# EAGLE design espertowatch_v2 (EAGLE 9.0.1)

## Sheet 1 of 2
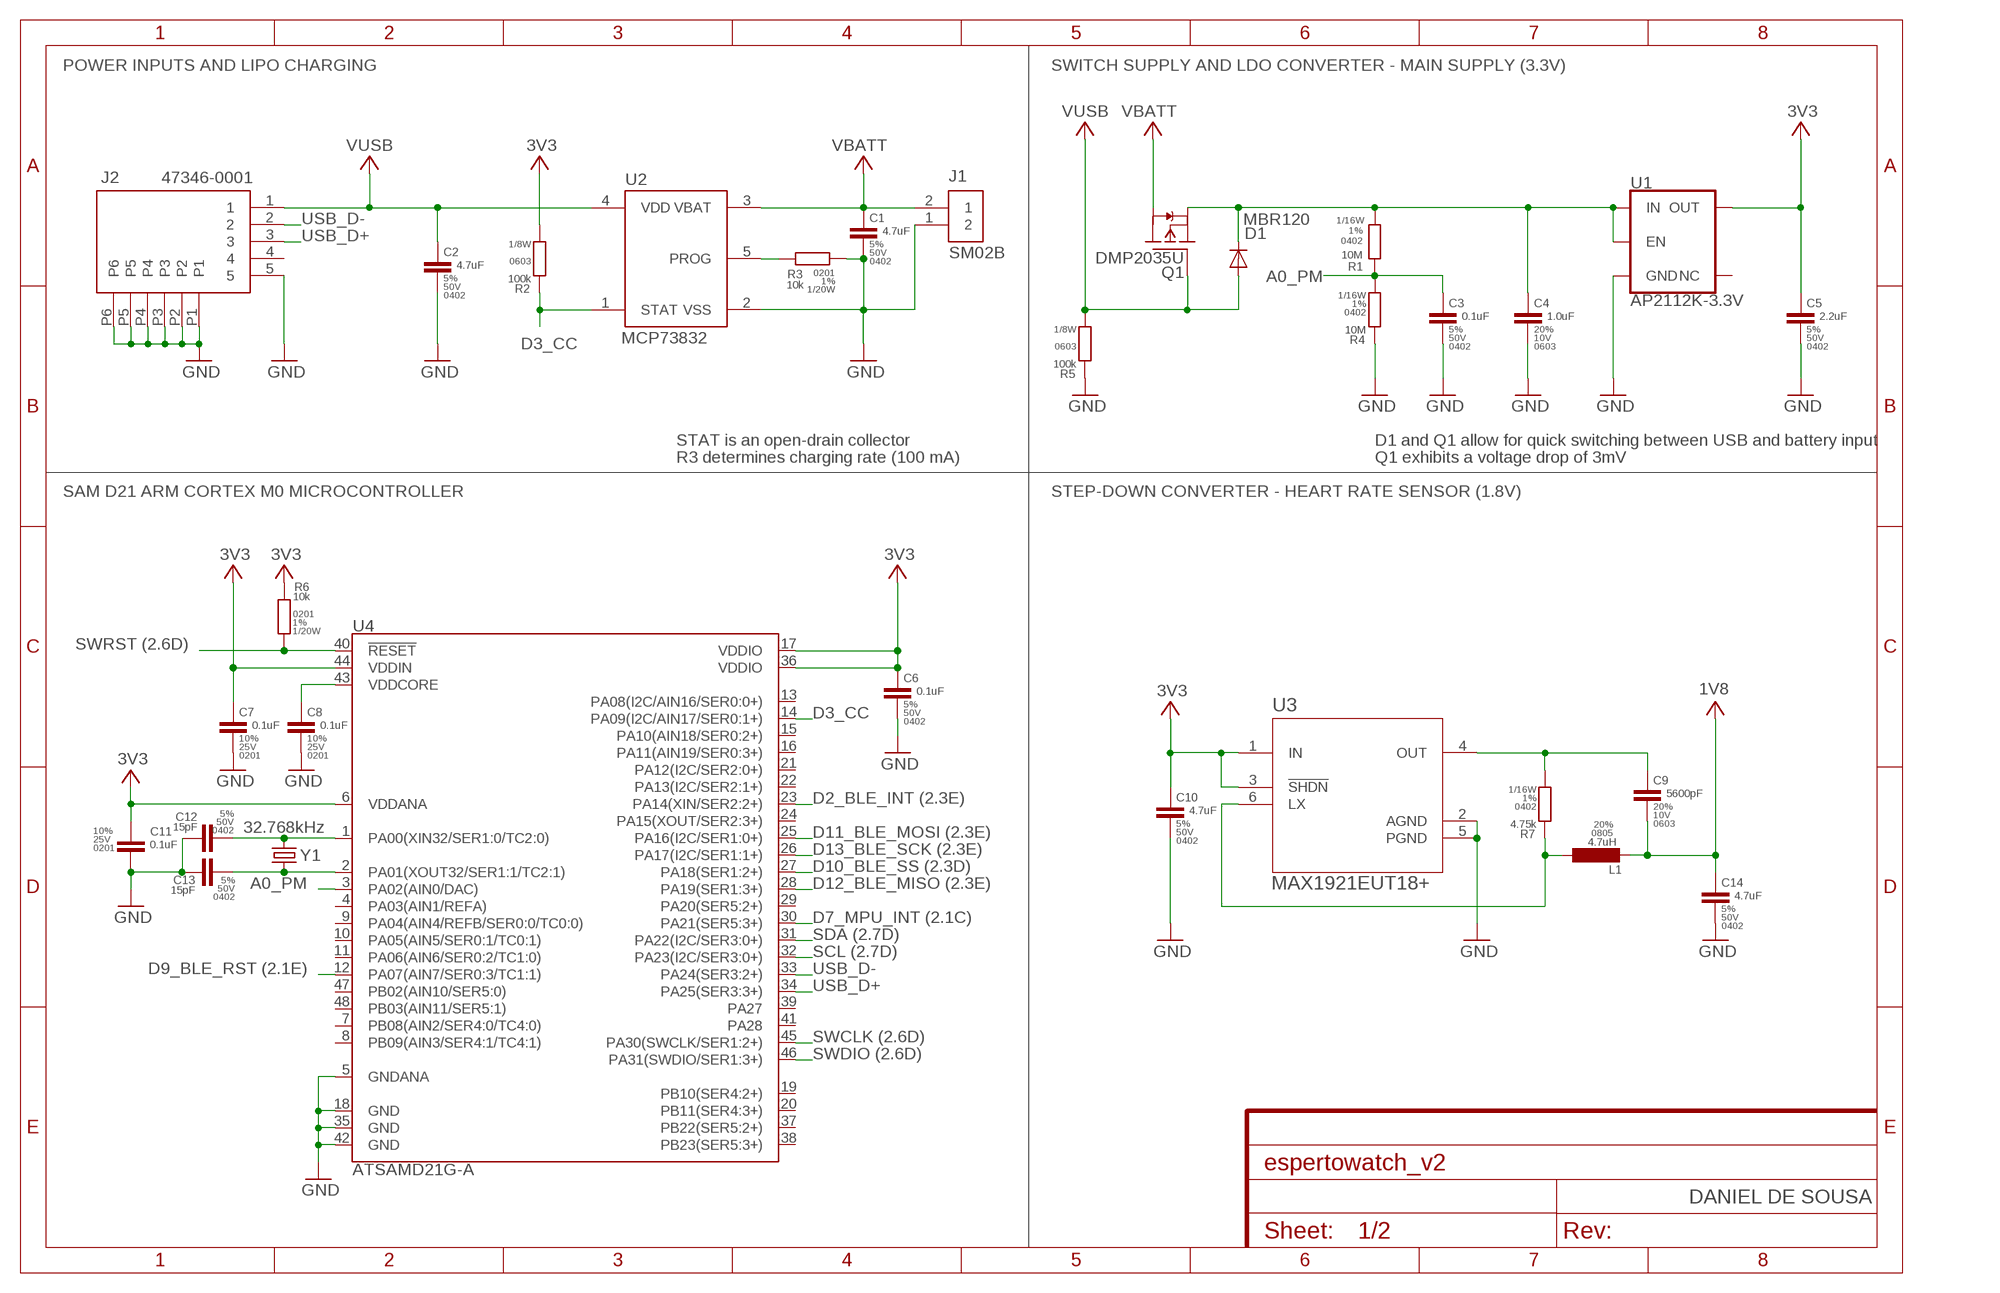
[diagram p0: schematic, sheet 1]

### Parts
C1  4.7uF  C-EUC0402_MURATA_GRM15-GJM15  [C0402_MURATA_GRM15-GJM15]
C2  4.7uF  C-EUC0402_MURATA_GRM15-GJM15  [C0402_MURATA_GRM15-GJM15]
C3  0.1uF  C-EUC0402_MURATA_GRM15-GJM15  [C0402_MURATA_GRM15-GJM15]
C4  1.0uF  C-EUC0603_MURATA_GRM18  [C0603_MURATA_GRM18]
C5  2.2uF  C-EUC0402_MURATA_GRM15-GJM15  [C0402_MURATA_GRM15-GJM15]
C6  0.1uF  C-EUC0402_MURATA_GRM15-GJM15  [C0402_MURATA_GRM15-GJM15]
C7  0.1uF  C-EUC0201_MURATA_GRM03  [C0201_MURATA_GRM03]
C8  0.1uF  C-EUC0201_MURATA_GRM03  [C0201_MURATA_GRM03]
C9  5600pF  C-EUC0603_MURATA_GRM18  [C0603_MURATA_GRM18]
C10  4.7uF  C-EUC0402_MURATA_GRM15-GJM15  [C0402_MURATA_GRM15-GJM15]
C11  0.1uF  C-EUC0201_MURATA_GRM03  [C0201_MURATA_GRM03]
C12  15pF  C-EUC0402_MURATA_GRM15-GJM15  [C0402_MURATA_GRM15-GJM15]
C13  15pF  C-EUC0402_MURATA_GRM15-GJM15  [C0402_MURATA_GRM15-GJM15]
C14  4.7uF  C-EUC0402_MURATA_GRM15-GJM15  [C0402_MURATA_GRM15-GJM15]
D1  MBR120  AS-ITM-00111  [SOD-123FL]
J1  SM02B  AS-ITM-00231  [JST_SH_2X1]
J2  47346-0001  AS-ITM-00021  [MICRO_USB]
L1  4.7uH  L-EUL0805_TDK_MLZ  [L0805_TDK_MLZ]
Q1  DMP2035U  AS-ITM-00024  [SOT23]
R1  10M  CRCW04021M00FKED  [R0402_VISHAY_CRCW0402]
R2  100k  R-EU_R0603_VISHAY_MCT0603  [R0603_VISHAY_MCT0603]
R3  10k  CRCW020110K0FKED  [R0201_VISHAY_CRCW0201]
R4  10M  CRCW04021M00FKED  [R0402_VISHAY_CRCW0402]
R5  100k  R-EU_R0603_VISHAY_MCT0603  [R0603_VISHAY_MCT0603]
R6  10k  CRCW020110K0FKED  [R0201_VISHAY_CRCW0201]
R7  4.75k  R-EU_R0402_VISHAY_CRCW0402  [R0402_VISHAY_CRCW0402]
U1  AP2112K-3.3V  V_REG_AP2112K-3.3V  [SOT23-5]
U2  MCP73832  AS-ITM-00136  [SOT-23]
U3  MAX1921EUT18+  MAX1921EUT18+T  [21-0058I]
U4  ATSAMD21G-A  [TQFP-48]
Y1  32.768kHz  CRYSTAL-32.768KHZSMD-3.2X1.5  [CRYSTAL-SMD-3.2X1.5MM]

### Nets
1V8: C9.2 C14.1 L1.P$2 ; also sheet 2
3V3: C5.1 C6.1 C7.1 C10.1 C11.1 R2.2 R6.1 U1.5(OUT) U3.1(IN) U3.3(!SHDN) U4.6(VDDANA) U4.17(VDDIO) U4.36(VDDIO) U4.44(VDDIN) ; also sheet 2
A0_PM: C3.1 R1.1 R4.2 U4.3(PA02(AIN0/DAC))
D2_BLE_INT: U4.23(PA14(XIN/SER2:2+)) ; also sheet 2
D3_CC: R2.1 U2.1(STAT) U4.14(PA09(I2C/AIN17/SER0:1+))
D7_MPU_INT: U4.30(PA21(SER5:3+)) ; also sheet 2
D9_BLE_RST: U4.12(PA07(AIN7/SER0:3/TC1:1)) ; also sheet 2
D10_BLE_SS: U4.27(PA18(SER1:2+)) ; also sheet 2
D11_BLE_MOSI: U4.25(PA16(I2C/SER1:0+)) ; also sheet 2
D12_BLE_MISO: U4.28(PA19(SER1:3+)) ; also sheet 2
D13_BLE_SCK: U4.26(PA17(I2C/SER1:1+)) ; also sheet 2
GND: C1.2 C2.2 C3.2 C4.2 C5.2 C6.2 C7.2 C8.2 C10.2 C11.2 C12.1 C13.1 C14.2 J1.1 J2.5 J2.P1 J2.P2 J2.P3 J2.P4 J2.P5 J2.P6 R3.2 R4.1 R5.1 U1.2(GND) U2.2(VSS) U3.2(AGND) U3.5(PGND) U4.5(GNDANA) U4.18(GND) U4.35(GND) U4.42(GND) ; also sheet 2
N$1: C4.1 D1.C Q1.E(S) R1.2 U1.1(IN) U1.3(EN)
N$2: R3.1 U2.5(PROG)
N$5: C8.1 U4.43(VDDCORE)
N$6: C12.2 U4.1(PA00(XIN32/SER1:0/TC2:0)) Y1.P$2
N$7: C13.2 U4.2(PA01(XOUT32/SER1:1/TC2:1)) Y1.P$1
N$10: L1.P$1 R7.1 U3.6(LX)
N$15: C9.1 R7.2 U3.4(OUT)
SCL: U4.32(PA23(I2C/SER3:0+)) ; also sheet 2
SDA: U4.31(PA22(I2C/SER3:0+)) ; also sheet 2
SWCLK: U4.45(PA30(SWCLK/SER1:2+)) ; also sheet 2
SWDIO: U4.46(PA31(SWDIO/SER1:3+)) ; also sheet 2
SWRST: R6.2 U4.40(!RESET!) ; also sheet 2
USB_D+: J2.3 U4.34(PA25(SER3:3+))
USB_D-: J2.2 U4.33(PA24(SER3:2+))
VBATT: C1.1 J1.2 Q1.C(D) U2.3(VBAT)
VUSB: C2.1 D1.A J2.1 Q1.B(G) R5.2 U2.4(VDD)
Unconnected: J2.4 U1.4(NC) U4.4(PA03(AIN1/REFA)) U4.7(PB08(AIN2/SER4:0/TC4:0)) U4.8(PB09(AIN3/SER4:1/TC4:1)) U4.9(PA04(AIN4/REFB/SER0:0/TC0:0)) U4.10(PA05(AIN5/SER0:1/TC0:1)) U4.11(PA06(AIN6/SER0:2/TC1:0)) U4.13(PA08(I2C/AIN16/SER0:0+)) U4.15(PA10(AIN18/SER0:2+)) U4.16(PA11(AIN19/SER0:3+)) U4.19(PB10(SER4:2+)) U4.20(PB11(SER4:3+)) U4.21(PA12(I2C/SER2:0+)) U4.22(PA13(I2C/SER2:1+)) U4.24(PA15(XOUT/SER2:3+)) U4.29(PA20(SER5:2+)) U4.37(PB22(SER5:2+)) U4.38(PB23(SER5:3+)) U4.39(PA27) U4.41(PA28) U4.47(PB02(AIN10/SER5:0)) U4.48(PB03(AIN11/SER5:1))

### Notes on the sheet
- POWER INPUTS AND LIPO CHARGING | SWITCH SUPPLY AND LDO CONVERTER - MAIN SUPPLY (3.3V)
- STAT is an open-drain collector | D1 and Q1 allow for quick switching between USB and battery input
- R3 determines charging rate (100 mA) | Q1 exhibits a voltage drop of 3mV
- SAM D21 ARM CORTEX M0 MICROCONTROLLER | STEP-DOWN CONVERTER - HEART RATE SENSOR (1.8V)
- DANIEL DE SOUSA

## Sheet 2 of 2
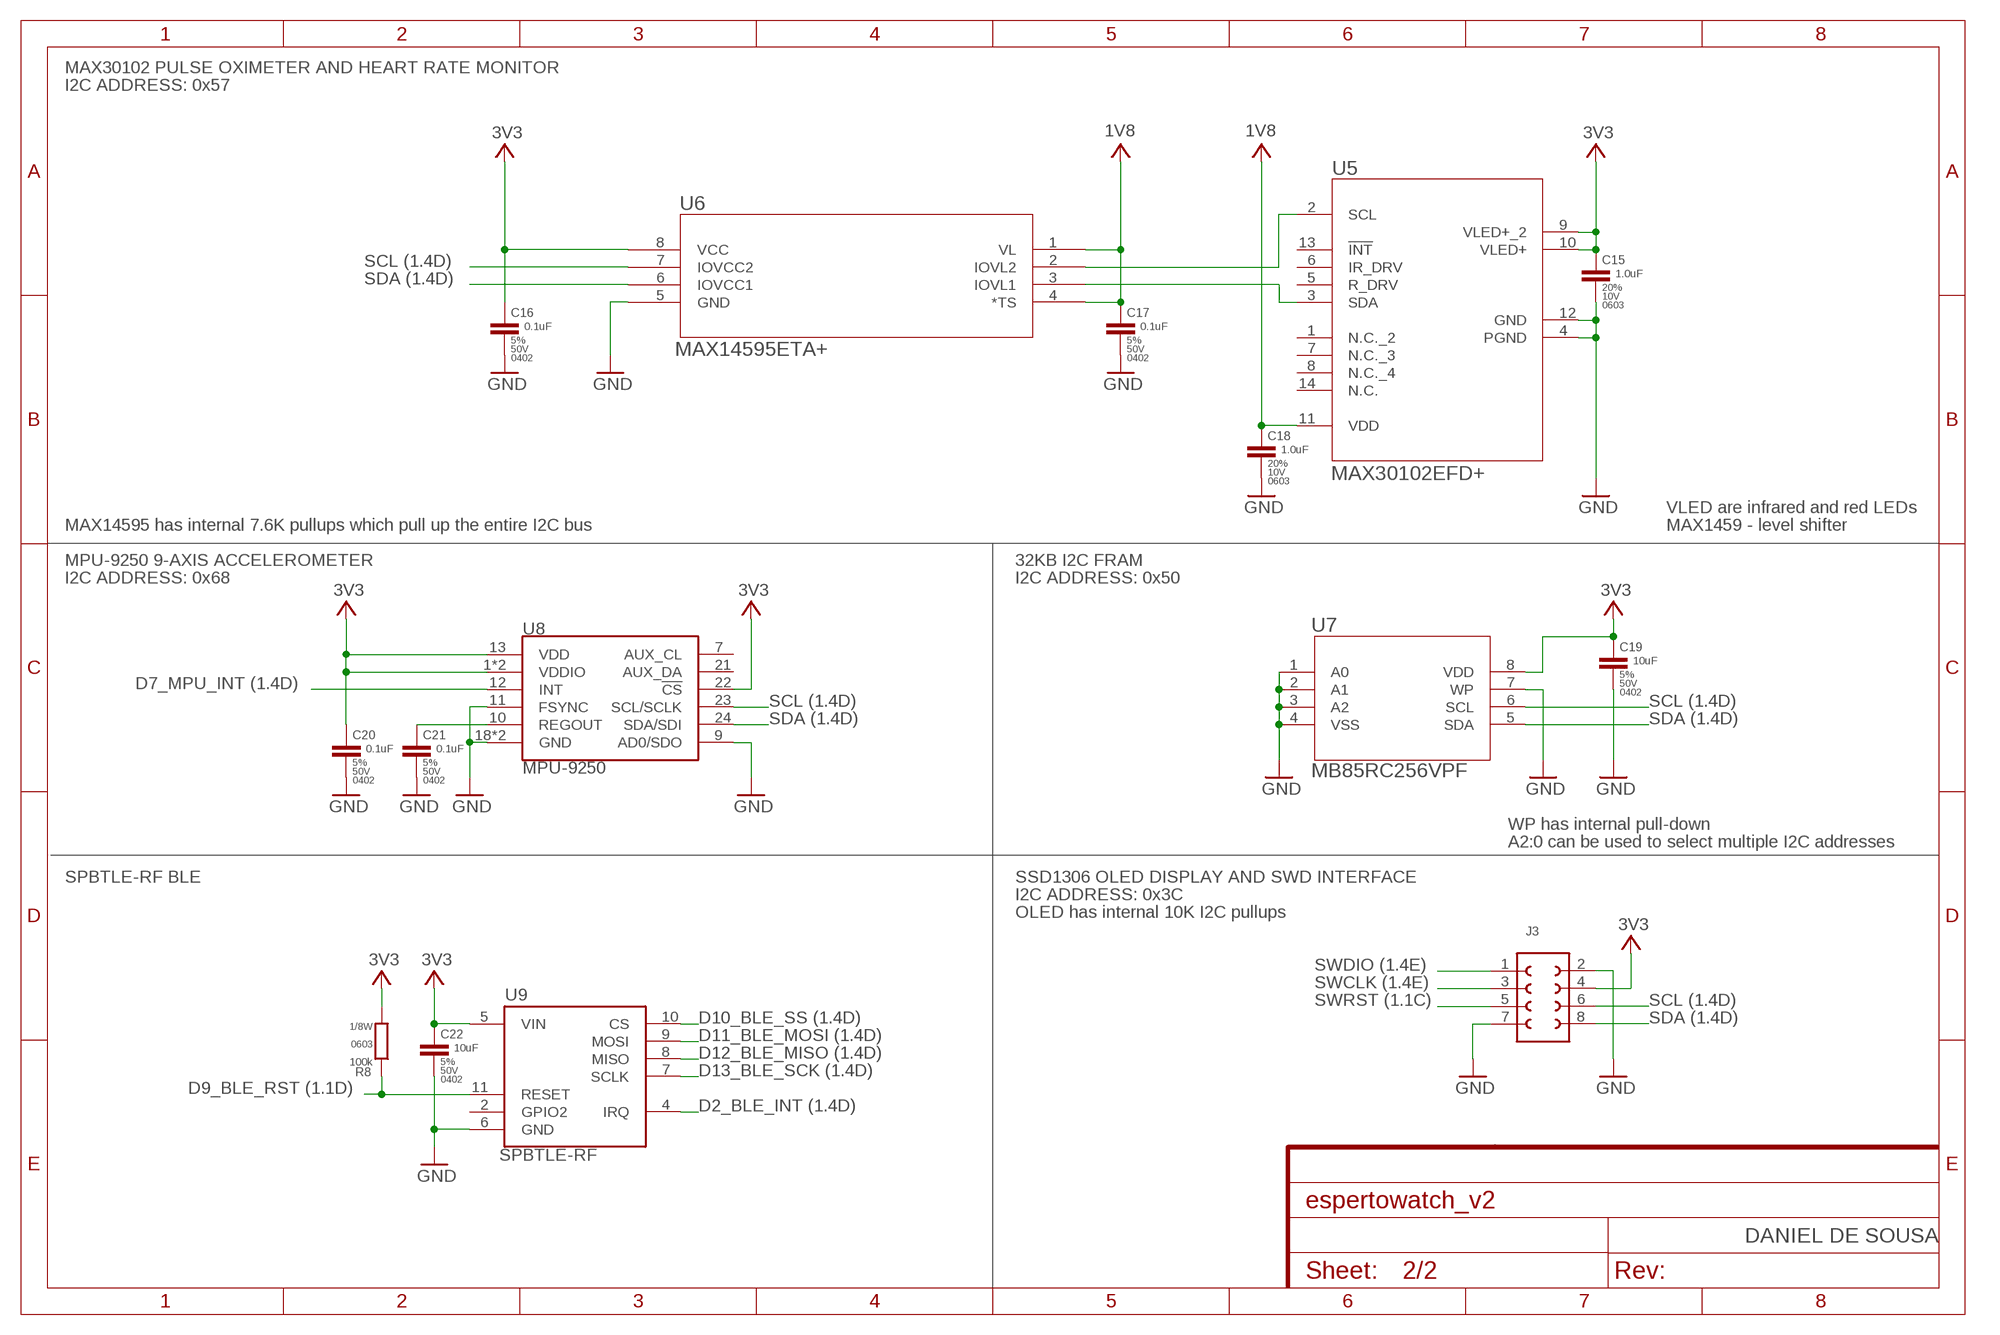
[diagram p1: schematic, sheet 2]

### Parts
C15  1.0uF  C-EUC0603_MURATA_GRM18  [C0603_MURATA_GRM18]
C16  0.1uF  C-EUC0402_MURATA_GRM15-GJM15  [C0402_MURATA_GRM15-GJM15]
C17  0.1uF  C-EUC0402_MURATA_GRM15-GJM15  [C0402_MURATA_GRM15-GJM15]
C18  1.0uF  C-EUC0603_MURATA_GRM18  [C0603_MURATA_GRM18]
C19  10uF  C-EUC0402_MURATA_GRM15-GJM15  [C0402_MURATA_GRM15-GJM15]
C20  0.1uF  C-EUC0402_MURATA_GRM15-GJM15  [C0402_MURATA_GRM15-GJM15]
C21  0.1uF  C-EUC0402_MURATA_GRM15-GJM15  [C0402_MURATA_GRM15-GJM15]
C22  10uF  C-EUC0402_MURATA_GRM15-GJM15  [C0402_MURATA_GRM15-GJM15]
J3  610X08243021  [610X08243021]
R8  100k  R-EU_R0603_VISHAY_MCT0603  [R0603_VISHAY_MCT0603]
U5  MAX30102EFD+  MAX30102EFD+21-0880B-M  [21-0880B-M]
U6  MAX14595ETA+  MAX14595ETAT  [21-0487A]
U7  MB85RC256VPF  INC.  [FPT-8P-M02]
U8  MPU-9250  [QFN24-3X3]
U9  SPBTLE-RF  AS-ITM-00294  [SPBTLE-RF]

### Nets
1V8: C17.1 C18.1 U5.11(VDD) U6.1(VL) U6.4(*TS) ; also sheet 1
3V3: C15.1 C16.1 C19.1 C20.1 C22.1 J3.4 R8.2 U5.9(VLED+_2) U5.10(VLED+) U6.8(VCC) U7.8(VDD) U8.1(VDDIO) U8.8(VDDIO) U8.13(VDD) U8.22(!CS) U9.5(VIN) ; also sheet 1
D2_BLE_INT: U9.4(IRQ) ; also sheet 1
D7_MPU_INT: U8.12(INT) ; also sheet 1
D9_BLE_RST: R8.1 U9.11(RESET) ; also sheet 1
D10_BLE_SS: U9.10(CS) ; also sheet 1
D11_BLE_MOSI: U9.9(MOSI) ; also sheet 1
D12_BLE_MISO: U9.8(MISO) ; also sheet 1
D13_BLE_SCK: U9.7(SCLK) ; also sheet 1
GND: C15.2 C16.2 C17.2 C18.2 C19.2 C20.2 C21.2 C22.2 J3.2 J3.7 U5.4(PGND) U5.12(GND) U6.5(GND) U7.1(A0) U7.2(A1) U7.3(A2) U7.4(VSS) U7.7(WP) U8.9(AD0/SDO) U8.11(FSYNC) U8.18(GND) U8.20(GND) U9.6(GND) ; also sheet 1
N$14: C21.1 U8.10(REGOUT)
N$16: U5.2(SCL) U6.2(IOVL2)
N$17: U5.3(SDA) U6.3(IOVL1)
SCL: J3.6 U6.7(IOVCC2) U7.6(SCL) U8.23(SCL/SCLK) ; also sheet 1
SDA: J3.8 U6.6(IOVCC1) U7.5(SDA) U8.24(SDA/SDI) ; also sheet 1
SWCLK: J3.3 ; also sheet 1
SWDIO: J3.1 ; also sheet 1
SWRST: J3.5 ; also sheet 1
Unconnected: U5.1(N.C._2) U5.5(R_DRV) U5.6(IR_DRV) U5.7(N.C._3) U5.8(N.C._4) U5.13(!INT) U5.14(N.C.) U8.7(AUX_CL) U8.21(AUX_DA) U9.2(GPIO2)

### Notes on the sheet
- MAX30102 PULSE OXIMETER AND HEART RATE MONITOR
- I2C ADDRESS: 0x57
- VLED are infrared and red LEDs
- MAX14595 has internal 7.6K pullups which pull up the entire I2C bus | MAX1459 - level shifter
- MPU-9250 9-AXIS ACCELEROMETER | 32KB I2C FRAM
- I2C ADDRESS: 0x68 | I2C ADDRESS: 0x50
- WP has internal pull-down
- A2:0 can be used to select multiple I2C addresses
- SPBTLE-RF BLE | SSD1306 OLED DISPLAY AND SWD INTERFACE
- I2C ADDRESS: 0x3C
- OLED has internal 10K I2C pullups
- DANIEL DE SOUSA

## Library data of the parts
C1-C3 C5 C6 C10 C12-C14 C16 C17 C19-C22 = CAPACITOR:C-EU: CAPACITOR, European symbol; PACKAGE: 0402; RATING: 50V; TOLERANCE: 5%
C4 C9 C15 C18 = CAPACITOR:C-EU: CAPACITOR, European symbol; PACKAGE: 0603; RATING: 10V; TOLERANCE: 20%
C7 C8 C11 = CAPACITOR:C-EU: CAPACITOR, European symbol; PACKAGE: 0201; RATING: 25V; TOLERANCE: 10%
D1 = tinycircuits:AS-ITM-00111: DIODE SCHOTTKY 20V 1A SOD123L; PARTNO: AS-ITM-00111; PNPROTATION: 0; VALUE: MBR120VLSFT1G
J1 = tinycircuits:AS-ITM-00231: CONN HEADER SH 2POS SIDE 1MM; PARTNO: AS-ITM-00231; PNPROTATION: 180; VALUE: SM02B-SRSS-TB(LF)(SN)
J2 = tinycircuits:AS-ITM-00021: CONN RCPT 5POS MICRO USB R/A; PARTNO: AS-ITM-00021; PNPROTATION: 90
J3 = Board-to-Board (rev18a):610X08243021: WR-PHD 2.54mm SMT Dual Socket Header Bottom Entry, 8 Pins=>Code : Con_BTB_SHD_2.54_2_610x08243021(packageing:x = 0: Tube x = 3: Tape & Reel with Cap) <http://katalog.we-online.de/media/images/eican/Con_BTB_SHD_2.54_2_6100xx243021_pf2.jpg> Details see: 6100xx243021 http://katalog.we-online.de/en/em/PHD_2_54_SMT_DUAL_SOCKET_HEADER_BOTTOM_ENTRY_6100XX243021 6103xx243021 http://katalog.we-online.de/en/em/PHD_2_54_SMT_DUAL_SOCKET_HEADER_BOTTOM_ENTRY_6103XX243021 2014 (C) Würth Elektronik
L1 = INDUCTOR:L-EU: INDUCTOR, European symbol; PACKAGE: 0805; TOLERANCE: 20%
Q1 = tinycircuits:AS-ITM-00024: P-Channel MOSFET SOT-23; PARTNO: AS-ITM-00024; PNPROTATION: 0
R1 R4 = RESISTOR:CRCW04021M00FKED; PACKAGE: 0402; RATING: 1/16W; TOLERANCE: 1%; VALUE: 1M
R2 R5 R8 = RESISTOR:R-EU_: RESISTOR, European symbol; PACKAGE: 0603; RATING: 1/8W
R3 R6 = RESISTOR:CRCW020110K0FKED; PACKAGE: 0201; RATING: 1/20W; TOLERANCE: 1%
R7 = RESISTOR:R-EU_: RESISTOR, European symbol; PACKAGE: 0402; RATING: 1/16W; TOLERANCE: 1%
U1 = SparkFun-IC-Power:V_REG_AP2112: AP2112 - 600mA CMOS LDO Regulator w/ Enable The AP2112 is CMOS process low dropout linear regulator with enable function, the regulator delivers a guaranteed 600mA (min.) continuous load current. Features Output Voltage Accuracy: ±1.5% Output Current: 600mA (Min.) Foldback Short Current Protection: 50mA Enable Function to Turn ON/OFF VOUT Low Dropout Voltage (3.3V): 250mV (Typ.) @IOUT=600mA Excellent Load Regulation: 0.2%/A (Typ.) Excellent Line Regulation: 0.02%/V (Typ.) Low Quiescent Current: 55μA (Typ.) Low Standby Current: 0.01μA (Typ.) Low Output Noise: 50μVRMS PSRR: 100Hz -65dB, 1kHz -65dB OTSD Protection Stable with 1.0μF Flexible Cap: Ceramic, Tantalum and Aluminum Electrolytic Operation Temperature Range: -40°C to 85°C ESD: MM 400V, HBM 4000V; PROD_ID: VREG-12457; VALUE: 3.3V
U2 = tinycircuits:AS-ITM-00136: IC CONTROLLER LI-ION 4.2V SOT23-5; PARTNO: AS-ITM-00136; PNPROTATION: 270; VALUE: MCP73831
U3 = MAX1921-1.8:MAX1921EUT18+T; MANUFACTURER_PART_NUMBER: MAX1921EUT18+T; VENDOR: Maxim Integrated Products
U4 = SparkFun-IC-Microcontroller:ATSAMD21G: Atmel SAMD21G SMART ARM-Based Microcontroller The Atmel ® | SMART ™ SAM D21 is a series of low-power microcontrollers using the 32-bit ARM ® Cortex ® -M0+ processor, and ranging from 32- to 64-pins with up to 256KB Flash and 32KB of SRAM. The SAM D21 devices operate at a maximum frequency of 48MHz and reach 2.46 CoreMark/MHz. They are designed for simple and intuitive migration with identical peripheral modules, hex compatible code, identical linear address map and pin compatible migration paths between all devices in the product series. All devices include intelligent and flexible peripherals, Atmel Event System for inter-peripheral signaling, and support for capacitive touch button, slider and wheel user interfaces. Datasheet <https://cdn.sparkfun.com/datasheets/Dev/Arduino/Boards/Atmel-42181-SAM-D21_Datasheet.pdf> SparkFun Products SparkFun SAMD21 Mini Breakout <https://www.sparkfun.com/products/13664> (DEV-13664) SparkFun SAMD21 Dev Breakout <https://www.sparkfun.com/products/13672> (DEV-13672); PROD_ID: IC-13064
U5 = MAX30102:MAX30102EFD+; MANUFACTURER_PART_NUMBER: MAX30102EFD+; VENDOR: Maxim Integrated Products
U6 = MAX14595ETAT:MAX14595ETAT; DESCRIPTION: Logic Level Translator 8-Pin TDFN T/R; DIGI-KEY_PART_NUMBER: MAX14595ETA+TCT-ND; DIGI-KEY_PURCHASE_URL: https://www.digikey.ca/product-detail/en/maxim-integrated/MAX14595ETA-T/MAX14595ETA-TCT-ND/6166867?utm_source=snapeda&utm_medium=aggregator&utm_campaign=symbol; MF: Maxim Integrated; MP: MAX14595ETA+T; PACKAGE: TDFN-8 Maxim Integrated
U7 = FRAM:INC.; MANUFACTURER_PART_NUMBER: Inc.; VENDOR: Fujitsu Semiconductor
U8 = SparkFun-Sensors:MPU-9250: MPU-9250 9 Degree of Freedom IMU System in Package that contains MPU-6500 & AK8963 NC pin 19. 2-6 & 14-17 not internally connected. May be used for PCB trace routing. Datasheet <https://cdn.sparkfun.com/assets/learn_tutorials/5/5/0/MPU9250REV1.0.pdf> SparkFun Products: SparkFun 9DoF Razor IMU M0 <https://www.sparkfun.com/products/14001> SparkFun IMU Breakout - MPU-9250 <https://www.sparkfun.com/products/13762>; PROD_ID: IC-13192; VALUE: 9DoF IMU
U9 = tinycircuits:AS-ITM-00294: MODULE BLE; PARTNO: AS-ITM-00294
Y1 = SparkFun-Clocks:CRYSTAL-32.768KHZ: 32.768kHz Crystal Frequency: 32.768kHz Frequency Stability: ±20ppm Load Capacitance: 12.5pF (PTH-2X6 & SMD-3.2X1.5), 6pF (SMD-2X6) SparkFun Products: SparkFun BigTime Watch Kit <https://www.sparkfun.com/products/11734> SparkFun nRF52832 Breakout <https://www.sparkfun.com/products/13990> SparkFun Real Time Clock Module <https://www.sparkfun.com/products/12708>; PROD_ID: XTAL-13062

## Board
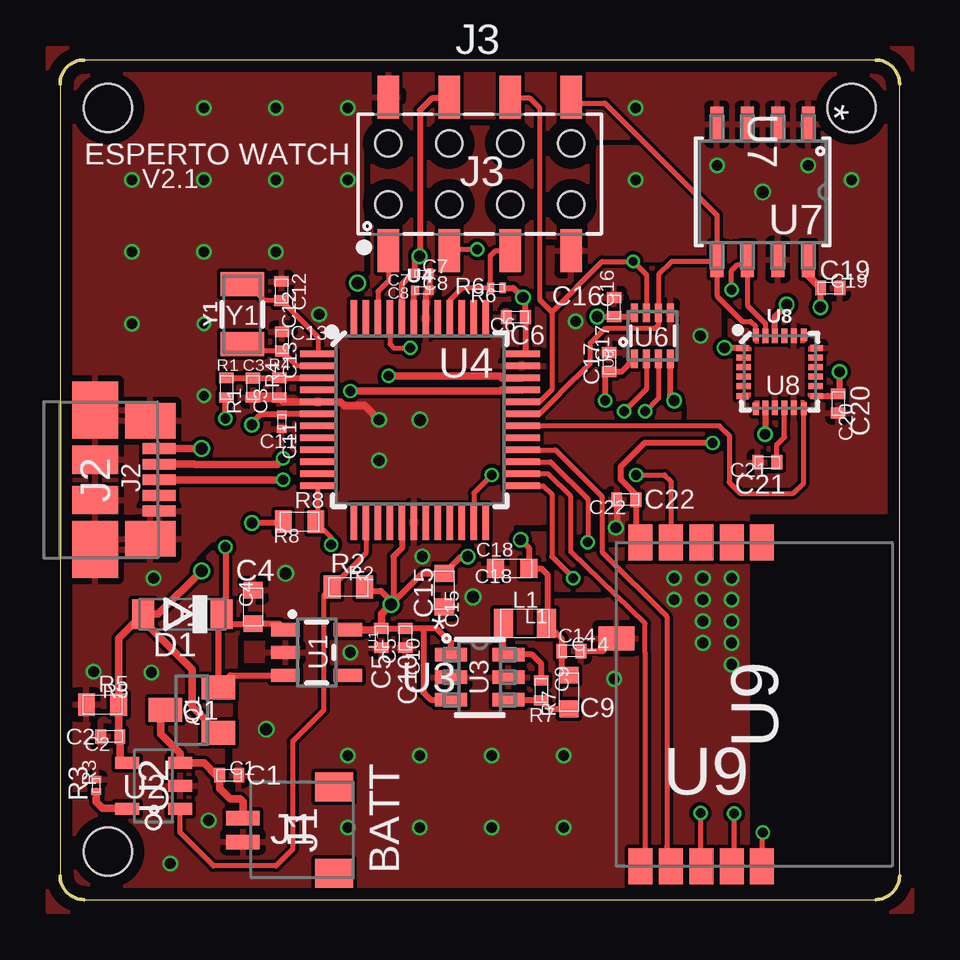
[diagram p2: board, top side]
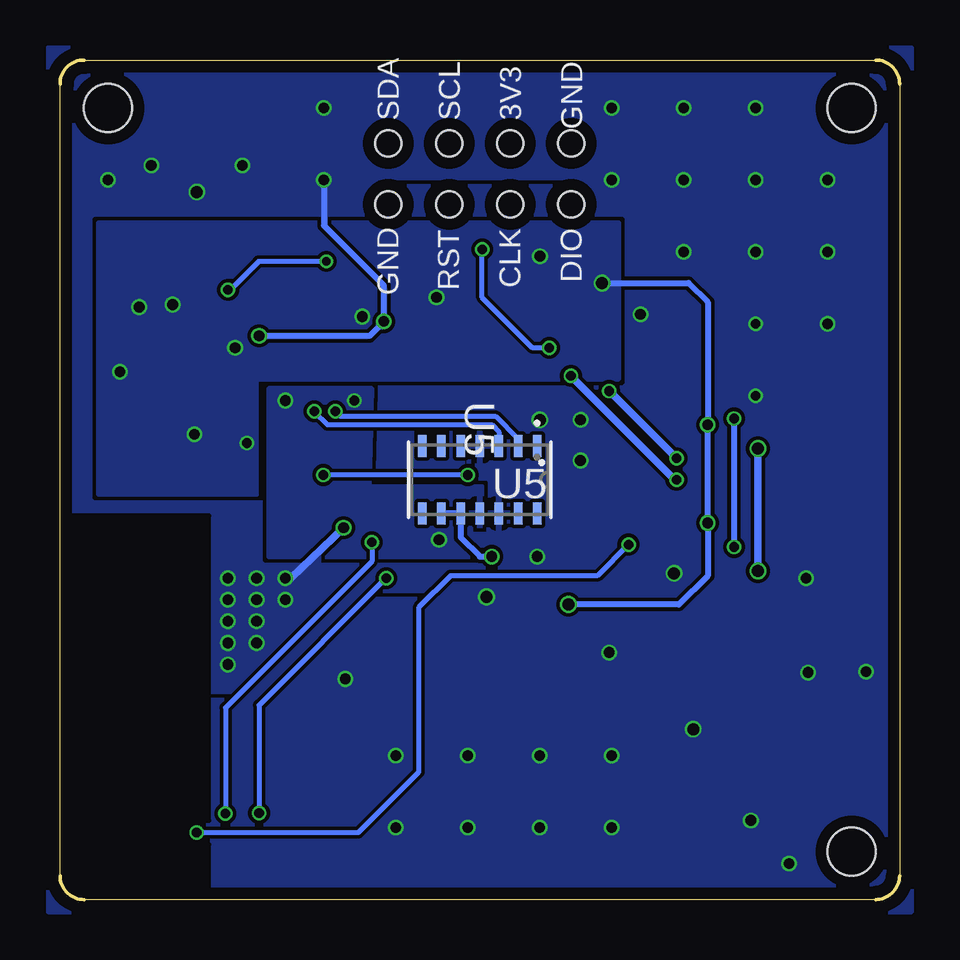
[diagram p3: board, bottom side, seen from below]

Size 35 x 35 mm. Coordinates in mm from the lower left corner, seen from the top.
Outline: 1,0 34,0 arc90 35,1 35,34 arc90 34,35 1,35 arc90 0,34 0,1 arc90 1,0
Copper layers (1*16): Top 0.035mm / dielectric 1.5mm / Bottom 0.035mm
Design rules "default *": minimum track width 6mil, minimum drill 0.4mm, track to track 6mil, track to pad 6mil, pad to pad 6mil, via to via 6mil, smd to smd 0mil, copper to edge 0.5mm, drill to drill 0.2mm, minimum pad ring 0.1mm, minimum via ring 0.1mm, stop-mask expansion 4mil, vias tented up to drill 0mil, thermal gap 10mil
Holes 2 mm at 2,2 2,33 33,33
tRestrict: area 29,0 to 35,16; 37 lines
bRestrict: area 28.8,0 to 35,16; 4 lines

### Footprints (pad centres in the part's own frame; a part is rotated, then mirrored left to right if it is on the bottom)
C0402_MURATA_GRM15-GJM15 = smd 0.45 x 0.6: 1 -0.4,0; 2 0.4,0
C0603_MURATA_GRM18 = smd 0.7 x 0.8: 1 -0.7,0; 2 0.7,0
C0201_MURATA_GRM03 = smd 0.35 x 0.4: 1 -0.3,0; 2 0.3,0
SOD-123FL = smd 0.914 x 1.219: A 1.638,0; C -1.638,0
JST_SH_2X1 = smd 0.6 x 1.4: 1 -0.5,2.475; 2 0.5,2.475 | smd 1.2 x 1.6: PAD1 -1.8,-1.325; PAD2 1.8,-1.325
MICRO_USB = smd 1.38 x 0.45: 1 2.66,1.3; 2 2.66,0.65; 3 2.66,0; 4 2.66,-0.65; 5 2.66,-1.3 | smd 2.1 x 1.475: P1 2.3,-2.462; P2 2.3,2.462 | smd 1.9 x 2.375: P3 0,2.913; P4 0,-2.913 | smd 1.9 x 1.175: P5 0,0.838; P6 0,-0.838
610X08243021 = smd 0.9 x 1.8: 1 -3.81,-3.2; 2 -3.81,3.2; 3 -1.27,-3.2; 4 -1.27,3.2; 5 1.27,-3.2; 6 1.27,3.2; 7 3.81,-3.2; 8 3.81,3.2 | hole 1.1: -3.81,1.27; -1.27,1.27; -1.27,-1.27; -3.81,-1.27; 1.27,1.27; 1.27,-1.27; 3.81,1.27; 3.81,-1.27
L0805_TDK_MLZ = smd 0.8 x 1.2: P$1 -0.9,0; P$2 0.9,0
SOT23 = smd 1 x 1.4: B -0.95,-1.1; C 0,1.1; E 0.95,-1.1
R0402_VISHAY_CRCW0402 = smd 0.425 x 0.6: 1 -0.412,0; 2 0.412,0
R0603_VISHAY_MCT0603 = smd 0.7 x 0.95: 1 -0.675,0; 2 0.675,0
R0201_VISHAY_CRCW0201 = smd 0.28 x 0.43: 1 -0.255,0; 2 0.255,0
SOT23-5 = smd 0.55 x 1.2: 1 -0.95,-1.3; 2 0,-1.3; 3 0.95,-1.3; 4 0.95,1.3; 5 -0.95,1.3
SOT-23 = smd 0.5 x 1: 1 -0.95,-1.1; 2 0,-1.1; 3 0.95,-1.1; 4 0.95,1.1; 5 -0.95,1.1
21-0058I = smd 1.321 x 0.559: 1 -1.194,0.94; 2 -1.194,0; 3 -1.194,-0.94; 4 1.194,-0.94; 5 1.194,0; 6 1.194,0.94
TQFP-48 = smd 1.5 x 0.28: 1 -4.25,2.75; 2 -4.25,2.25; 3 -4.25,1.75; 4 -4.25,1.25; 5 -4.25,0.75; 6 -4.25,0.25; 7 -4.25,-0.25; 8 -4.25,-0.75; 9 -4.25,-1.25; 10 -4.25,-1.75; 11 -4.25,-2.25; 12 -4.25,-2.75; 25 4.25,-2.75; 26 4.25,-2.25; 27 4.25,-1.75; 28 4.25,-1.25; 29 4.25,-0.75; 30 4.25,-0.25; 31 4.25,0.25; 32 4.25,0.75; 33 4.25,1.25; 34 4.25,1.75; 35 4.25,2.25; 36 4.25,2.75 | smd 0.28 x 1.5: 13 -2.75,-4.25; 14 -2.25,-4.25; 15 -1.75,-4.25; 16 -1.25,-4.25; 17 -0.75,-4.25; 18 -0.25,-4.25; 19 0.25,-4.25; 20 0.75,-4.25; 21 1.25,-4.25; 22 1.75,-4.25; 23 2.25,-4.25; 24 2.75,-4.25; 37 2.75,4.25; 38 2.25,4.25; 39 1.75,4.25; 40 1.25,4.25; 41 0.75,4.25; 42 0.25,4.25; 43 -0.25,4.25; 44 -0.75,4.25; 45 -1.25,4.25; 46 -1.75,4.25; 47 -2.25,4.25; 48 -2.75,4.25
21-0880B-M = smd 0.914 x 0.356: 1 -1.397,2.4; 2 -1.397,1.6; 3 -1.397,0.8; 4 -1.397,0; 5 -1.397,-0.8; 6 -1.397,-1.6; 7 -1.397,-2.4; 8 1.397,-2.4; 9 1.397,-1.6; 10 1.397,-0.8; 11 1.397,0; 12 1.397,0.8; 13 1.397,1.6; 14 1.397,2.4
21-0487A = smd 0.762 x 0.305: 1 -0.953,0.75; 2 -0.953,0.25; 3 -0.953,-0.25; 4 -0.953,-0.75; 5 0.953,-0.75; 6 0.953,-0.25; 7 0.953,0.25; 8 0.953,0.75
FPT-8P-M02 = smd 1.473 x 0.559: 1 -2.819,1.905; 2 -2.819,0.635; 3 -2.819,-0.635; 4 -2.819,-1.905; 5 2.819,-1.905; 6 2.819,-0.635; 7 2.819,0.635; 8 2.819,1.905
QFN24-3X3 = smd 0.495 x 0.25: 1 -1.552,1; 6 -1.552,-1; 13 1.552,-1; 18 1.552,1 | smd 0.6 x 0.25: 2 -1.5,0.6; 3 -1.5,0.2; 4 -1.5,-0.2; 5 -1.5,-0.6; 14 1.5,-0.6; 15 1.5,-0.2; 16 1.5,0.2; 17 1.5,0.6 | smd 0.25 x 0.495: 7 -1,-1.552; 12 1,-1.552; 19 1,1.552; 24 -1,1.552 | smd 0.25 x 0.6: 8 -0.6,-1.5; 9 -0.2,-1.5; 10 0.2,-1.5; 11 0.6,-1.5; 20 0.6,1.5; 21 0.2,1.5; 22 -0.2,1.5; 23 -0.6,1.5
SPBTLE-RF = smd 1.5 x 1: 1 -6.75,0.33; 2 -6.75,-0.94; 3 -6.75,-2.21; 4 -6.75,-3.48; 5 -6.75,-4.75; 7 6.75,-4.75; 8 6.75,-3.48; 9 6.75,-2.21; 10 6.75,-0.94; 11 6.75,0.33 | smd 1 x 1.5: 6 -2.75,-5.75
CRYSTAL-SMD-3.2X1.5MM = smd 1 x 1.8: P$1 -1.25,0; P$2 1.25,0

### Placement (x,y rotation side)
C1  7.06,5.19 0 top
C2  2.1,6.8 180 top
C3  8.04,21.33 270 top
C4  8.05,12.2 90 top
C5  13.4,10.9 270 top
C6  19,24.28 180 top
C7  15.1,26.1 0 top
C8  15.1,25.4 0 top
C9  21.22,8.65 90 top
C10  14.4,10.9 270 top
C11  9.25,19.92 270 top
C12  9.23,25.37 270 top
C13  9.26,23.27 270 top
C14  21.32,10.36 0 top
C15  16.02,12.9 270 top
C16  23.1,24.7 90 top
C17  22.9,22.4 90 top
C18  18.85,13.8 180 top
C19  32.11,25.5 0 top
C20  32.44,20.68 270 top
C21  29.49,18.23 180 top
C22  23.61,16.67 180 top
D1  5.1,11.9 180 top
J1  10.1,2.9 90 top
J2  1.47,17.5 0 top
J3  17.5,30.25 0 top
L1  19.39,11.51 0 top
Q1  5.5,7.9 90 top
R1  6.94,21.33 270 top
R2  12.02,13.04 0 top
R3  1.51,4.76 90 top
R4  9.14,21.33 90 top
R5  1.78,8.13 0 top
R6  18.2,25.5 180 top
R7  20.06,8.72 270 top
R8  9.99,15.75 180 top
U1  10.7,10.3 270 top
U2  3.9,4.74 90 top
U3  17.5,9.27 0 top
U4  15,20 0 top
U5  17.5,17.5 270 bottom
U6  24.7,23.5 90 top
U7  29.29,29.5 270 top
U8  30,22 0 top
U9  28.94,8.14 270 top
Y1  7.6,24.4 90 top

### Tracks (layer width: path | path; a pad name or v marks a point on that pad's centre or on a via)
1V8  (via drill 0.4, 0.45)
  Top 0.254: 25.55,20.8 v25.6,20.8 25.45,20.95 U6.4 | v19.2,15 19.55,14.65 C18.1 20.07,13.8 20.32,13.54 20.32,11.54 L1.P$2 20.92,10.88 C14.1 20.92,9.65 C9.2 | v22.73,20.8 22.73,21.83 C17.1 23.4,22 U6.1
  pour Bottom: 26.3,21.3 26.3,14.3 17.4,14.3 17.4,17.2 22.1,17.2 22,21.3
3V3  (via drill 0.4, 0.45, 0.5)
  Top 0.2: 19.4,22.9 U4.36 | 32,21 32.46,21 32.5,21.04 | U9.5 24.19,15.32 24.01,15.51 | J3.4 16.23,33.15 16.25,33.12
  Top 0.254: C5.1 C10.1 15.24,11.3 | U4.17 14.25,14.65 13.9,14.3 13.9,12.4 v13.8,12.3 | U8.13 32,21 32.44,21 | C20.1 32.5,21.04 v32.5,22 | U8.8 v29.4,19.4 | U8.1 v27.7,23 | 24,15.5 24.01,15.51 C22.1 24.01,16.88 23.37,17.52 23.37,18.03 24.36,19.03 v27.21,19.03 | 19.4,22.9 C6.1 19.4,25 v19.3,25.1 18.9,25.5 R6.1 | v22.4,24.3 C16.1 23.8,24.3 U6.8 | C7.1 14.8,26.2 | 14.8,26.2 14.8,26.63 v14.99,26.82 v15,26.83 15,32.9 15.5,33.4 16.18,33.4 J3.4 | v30.3,24.8 29.8,24.3 U8.22 | U4.44 14.25,25.65 14.8,26.2 | C19.1 v31.7,24.7 | v8,19.79 8,19.85 8.36,20.21 C11.1 9.28,20.25 U4.6 | U3.1 16.31,10.7 15.71,11.3 15.24,11.3 | 15.24,11.3 15.15,11.21 15.15,8.63 15.46,8.33 U3.3 | v13.8,12.3 15.1,13.6 C15.1 16.72,14.3 v17,14.3 | 12.77,12.96 R2.2 12.87,12.87 13.38,12.87 13.8,12.44 v13.8,12.3 | R8.2 9.27,15.7 v8,15.7
  Top 0.305: U1.5 13.35,11.25 C5.1 13.4,11.9 v13.8,12.3 | U7.8 31.2,26.01 C19.1
  Bottom 0.254: U5.9 U5.10 18.3,15.1 17.5,14.3 v17,14.3 | v13.8,12.3 9.2,12.3 8,13.5 v8,15.7 v8,19.79 8,24.9 8.8,25.7 v12.4,25.7
  pour Bottom: 11.7,21.7 11.7,28.2 33.4,28.2 33.4,16.9 26.8,16.9 26.8,21.7
A0_PM
  Top 0.2: U4.3 10.67,21.75 10.4,21.75
  Top 0.254: 10.4,21.75 10.6,21.75 | 7,21.8 R1.1 8.03,21.75 C3.1 9.02,21.73 9.09,21.8 R4.2 10.66,21.75 10.67,21.75
BOTTOM
  pour Bottom (rank 3): -0.5,35.5 35.5,35.5 35.5,-0.5 -0.5,-0.5
D2_BLE_INT  (via drill 0.4)
  Top 0.2: v18,17.7 17.25,16.95 U4.23 | v24.02,17.7 25.2,17.7 25.46,17.44 U9.4
  Bottom 0.2: v18,17.7 v24.02,17.7
D3_CC
  Top 0.2: U2.1 5,2.8 6.4,1.4 9,1.4 9.7,2.1 9.7,6.6 11,7.9 11,12.69 R2.1 12.75,14.44 U4.14
D7_MPU_INT
  Top 0.2: U4.30 27.5,19.75 27.9,19.35 27.9,17.39 28.36,16.93 30.56,16.93 31,17.37 U8.12
D9_BLE_RST  (via drill 0.4)
  Top 0.2: v29.3,2.8 29.27,2.77 U9.11 | v11.3,14.8 11.3,15.11 R8.1 10.75,15.83 U4.12
  Bottom 0.2: v11.3,14.8 12.6,13.5 18.72,13.5 20.05,12.17 20.05,5.31 22.56,2.8 v29.3,2.8
D10_BLE_SS  (via drill 0.4)
  Top 0.2: U4.27 20.45,18.25 22,16.7 v22,14.9 | v28.1,3.58 28.1,1.7 | 28.1,1.7 28,1.6 | U9.10 28.1,1.49 28.1,1.7
  Bottom 0.2: v22,14.9 22,14.1 28.1,8 v28.1,3.58
D11_BLE_MOSI  (via drill 0.4)
  Top 0.2: 26.7,1.83 26.73,1.8 | U4.25 20.15,17.25 20.5,16.9 20.5,14.3 v21.4,13.4 | 26.7,1.42 26.7,1 26.8,0.9 | U9.9 26.7,1.42 | 26.7,1.42 26.7,1.6 26.7,1.83 | v26.7,3.6 26.7,1.83
  Bottom 0.2: v21.4,13.4 26.7,8.1 v26.7,3.6
D12_BLE_MISO
  Top 0.2: U4.28 20.65,18.75 22.6,16.8 22.6,14.5 25.3,11.8 25.3,2.2 25.3,1.8 25.3,1.55 U9.8
D13_BLE_SCK
  Top 0.2: 24.39,10.28 24.39,10.29 | 24.39,10.29 24.39,11.51 21.3,14.5 21.3,16.8 20.35,17.75 19.7,17.75 19.4,17.75 U4.26 | 24.39,10.29 24.39,1.59 U9.7
GND  (via drill 0.4, 0.45, 0.5)
  Top 0.254: 22.84,11.24 U9.6 22.66,10.36 C14.2 | C22.2 23.21,15.55 | C7.2 C8.2 15.25,25.25 15.25,25.08 U4.42 | 8.05,20.92 C3.2
  Top 0.305: v13.3,20 12.71,20.59 11.85,20.59 11.7,20.75 U4.5 9.31,20.75 R4.1
  Top 0.406: R4.1 8.05,20.92
  Bottom 0.254: v26.7,23.5 22.1,23.5 v21.5,24.1 21.5,25.6 24,28.1 v24,30
  Bottom 0.305: v23.18,15.5 25.36,13.4 v25.6,13.4
  other vias: 15,20 8.6,7.1 29.29,29.5 21,6 9.4,13.6 17.22,12.62 28,13.4 26.8,13.4 28,12.5 26.8,12.5 25.6,12.5 26.8,11.6 28,11.6 28,10.7 26.8,10.7 28,9.8 6,33 9,33 12,33 3,30 3,27 3,24 15,3 18,3 21,3 24,33 33,30 6,21 10.8,24.4 13.3,18.3 18,6 15,6 31.19,30.6 27.39,30.6 1.4,9.5 3.9,13.4 4.6,1.5 6.2,3.3 12.1,10.3 15.1,14.3 6,30 9,30 6,27 9,27 3.81,9.47 12,6 12,3 6,24 12,30 23.1,9.2
  pour Top (rank 2): 0,35 35,35 35,16.15 28.65,16.15 28.65,0 0,0
  pour Bottom (rank 2): 0,35 35,35 35,16.15 28.65,16.15 28.65,0 0,0
N$1  (via drill 0.4)
  Top 0.2: D1.C 6.9,11.9
  Top 0.254: U1.3 7.1,9.35 Q1.E 6.6,11.76 D1.C 7.14,11.5 C4.1 9.15,11.5 U1.1 | v6.9,14.7 6.9,11.9 | v6.9,20.05 6.9,20.88 R1.2
  Bottom 0.254: v6.9,20.05 v6.9,14.7
N$2
  Top 0.305: U2.5 2.78,3.81 1.78,3.81 1.51,4.08 R3.1
N$5
  Top 0.254: U4.43 14.75,25.25 C8.1
N$6
  Top 0.2: Y1.P$2 7.95,25.55 8.53,24.97 C12.2 10.75,23.45 U4.1
N$7
  Top 0.2: U4.2 9.88,22.25 C13.2 7.88,22.87 Y1.P$1
N$10
  Top 0.254: L1.P$1 18.49,10.42 U3.6 19.68,10.21 20.06,9.82 R7.1
N$14
  Top 0.2: C21.1 29.89,18.97 30.2,19.28 U8.10
N$15
  Top 0.254: U3.4 20.04,8.33 R7.2 20.42,7.95 C9.1
N$16  (via drill 0.4)
  Top 0.2: U6.2 24.45,21.29 v23.52,20.35
  Bottom 0.2: U5.2 15.9,19.2 16.85,20.15 23.32,20.15 v23.52,20.35
N$17  (via drill 0.4)
  Top 0.2: U6.3 24.95,20.9 v24.4,20.35
  Bottom 0.2: U5.3 16.7,19.5 17,19.8 23.37,19.8 23.85,19.8 v24.4,20.35
SCL  (via drill 0.35, 0.4)
  Top 0.2: U8.23 29.4,24.02 28.66,24.76 U7.6 28.78,26.68 28.56,26.46 | 20.5,24.5 20,25 20,33 19.59,33.41 18.77,33.41 J3.6 | 20.5,24.5 20.5,21.25 20,20.75 U4.32 | 28.5,26.4 28.56,26.46 | v27.99,25.41 27.99,26.21 28.24,26.46 28.56,26.46 | 20.5,24.5 22.6,26.6 v23.9,26.6 24.45,26.05 U6.7
  Bottom 0.2: v27.99,25.41 27.95,25.38 26.73,26.6 v23.9,26.6
SDA
  Top 0.2: U4.31 20,20.25 20.85,21.1 20.85,21.11 22.1,22.35 22.1,23.2 22.12,23.2 22.72,23.8 24.8,23.8 24.95,23.95 U6.6 24.95,26.05 25.5,26.6 27.31,26.6 U7.5 | U8.24 29,23.9 28.8,24.1 28.45,24.1 27.39,25.16 U7.5 | 21.36,33.4 J3.8 21.56,33.2 22.72,33.2 27.39,28.53 U7.5
SWCLK  (via drill 0.4)
  Top 0.2: v17.4,27.1 16.28,27.1 J3.3 | U4.45 13.75,23.15 13.9,23 v14.6,23
  Bottom 0.2: v14.6,23 15.3,23 17.4,25.1 v17.4,27.1
SWDIO
  Top 0.2: J3.1 13.69,25.79 13.25,25.35 U4.46
SWRST
  Top 0.2: U4.40 16.25,25 16.75,25.5 R6.2 17.95,26.84 18.15,27.05 J3.5
TOP
  pour Top (rank 3): -0.5,35.5 35.5,35.5 35.5,-0.5 -0.5,-0.5
USB_D+  (via drill 0.4)
  Top 0.2: v9.3,17.5 | 19.23,21.73 U4.34
  Top 0.305: J2.3 v9.3,17.5 | v13.7,21.83 18.35,21.83 18.43,21.75 U4.34
  Bottom 0.305: v9.3,17.5 9.37,17.5 v13.7,21.83
USB_D-  (via drill 0.4)
  Top 0.305: J2.2 5.62,18.15 5.63,18.14 9.04,18.14 v9.3,18.4 | v12.1,21.2 18.35,21.2 18.4,21.25 U4.33
  Bottom 0.305: v9.3,18.4 v12.1,21.2
VBATT
  Top 0.305: Q1.C 4.2,7.7 4.2,6.9 5,6.1 U2.3 6.01,5.69 6.51,5.19 C1.1 6.66,4.64 7.1,4.2 7.5,4.2 7.62,4.08 J1.2
VUSB  (via drill 0.5)
  Top 0.254: D1.A 3.45,11.65
  Top 0.305: J2.1 v5.9,18.8 | v5.9,13.7 4.1,11.9 D1.A 2.45,10.89 R5.2 2.45,6.85 C2.1 | Q1.B 5.5,8.05 5.5,9.6 3.45,11.65 | 2.51,6.81 C2.1 | C2.1 2.48,6.78 | C2.1 2.5,5.65 U2.4
  Bottom 0.305: v5.9,18.8 v5.9,13.7

### Text on the board
_tsilk: ESPERTO WATCH | V2.1 | J3 | U7 | C7 | R6 | C16 | C19 | Y1 | C12 | C8 | C6 | U6 | R4 | C13 | C17 | R1 | C3 | U4 | U8 | C20 | C11 | C21 | J2 | R8 | C22 | C18 | R2 | C15 | C4 | L1 | D1 | C14 | U1 | C5 | C10 | R5 | U3 | Q1 | C9 | R7 | C2 | R3 | C1 | U2 | J1 | U9 | BATT
_bsilk: GND | SCL | 3V3 | SDA | DIO | CLK | RST | GND | U5